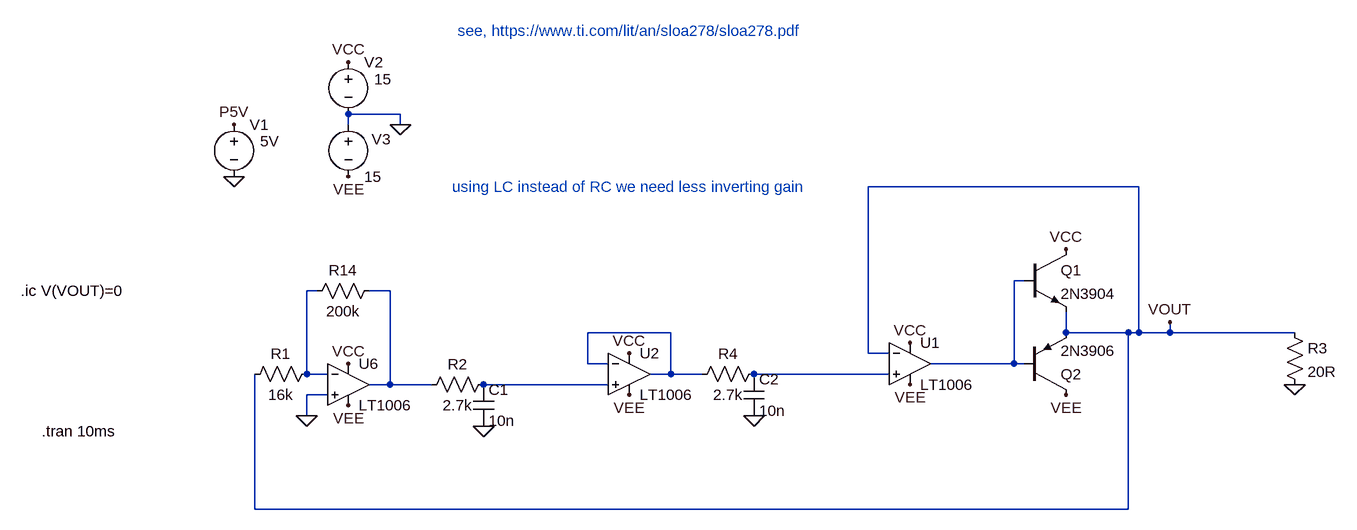
[diagram p0: schematic Draft02.asc]
Draft02.asc, the LTspice schematic file:
Version 4
SHEET 1 2720 868
WIRE -496 -112 -576 -112
WIRE -576 -96 -576 -112
WIRE -496 -96 -496 -112
WIRE 640 0 224 0
WIRE 464 144 448 144
WIRE -624 160 -640 160
WIRE -512 160 -544 160
WIRE -80 224 -208 224
WIRE 528 224 528 192
WIRE 624 224 528 224
WIRE 640 224 640 0
WIRE 640 224 624 224
WIRE 688 224 688 208
WIRE 688 224 640 224
WIRE 880 224 688 224
WIRE 224 256 224 0
WIRE 256 256 224 256
WIRE -208 272 -208 224
WIRE -176 272 -208 272
WIRE 448 272 448 144
WIRE 448 272 320 272
WIRE 464 272 448 272
WIRE -640 288 -640 160
WIRE -608 288 -640 288
WIRE -80 288 -80 224
WIRE -80 288 -112 288
WIRE -32 288 -80 288
WIRE 256 288 48 288
WIRE -512 304 -512 160
WIRE -512 304 -544 304
WIRE -448 304 -512 304
WIRE -176 304 -368 304
WIRE -608 320 -640 320
WIRE -640 352 -640 320
WIRE -720 496 -720 288
WIRE 624 496 624 224
WIRE 624 496 -720 496
FLAG -496 -96 0
FLAG -576 -192 VCC
FLAG -576 -16 VEE
FLAG -752 -96 P5V
FLAG -752 -16 0
FLAG -640 352 0
FLAG -576 272 VCC
FLAG -576 336 VEE
FLAG -368 368 0
FLAG 288 240 VCC
FLAG 288 304 VEE
FLAG 688 208 VOUT
FLAG -144 256 VCC
FLAG -144 320 VEE
FLAG 48 352 0
FLAG 528 96 VCC
FLAG 528 320 VEE
FLAG 880 304 0
SYMBOL voltage -576 -208 R0
WINDOW 123 0 0 Left 0
WINDOW 39 0 0 Left 0
WINDOW 3 40 42 Left 2
SYMATTR Value 15
SYMATTR InstName V2
SYMBOL voltage -576 -112 R0
WINDOW 123 0 0 Left 0
WINDOW 39 0 0 Left 0
WINDOW 0 36 39 Left 2
SYMATTR InstName V3
SYMATTR Value 15
SYMBOL voltage -752 -112 R0
WINDOW 123 0 0 Left 0
WINDOW 39 0 0 Left 0
WINDOW 3 40 42 Left 2
SYMATTR Value 5V
SYMATTR InstName V1
SYMBOL OpAmps\\LT1006 -576 240 R0
SYMATTR InstName U6
SYMBOL res -624 272 R90
WINDOW 0 0 56 VBottom 2
WINDOW 3 32 56 VTop 2
SYMATTR InstName R1
SYMATTR Value 16k
SYMBOL res -528 144 R90
WINDOW 0 0 56 VBottom 2
WINDOW 3 32 56 VTop 2
SYMATTR InstName R14
SYMATTR Value 200k
SYMBOL cap -384 304 R0
SYMATTR InstName C1
SYMATTR Value 10n
SYMBOL OpAmps\\LT1006 288 208 R0
SYMATTR InstName U1
SYMBOL OpAmps\\LT1006 -144 224 R0
SYMATTR InstName U2
SYMBOL cap 32 288 R0
SYMATTR InstName C2
SYMATTR Value 10n
SYMBOL npn 464 96 R0
SYMATTR InstName Q1
SYMATTR Value 2N3904
SYMBOL pnp 464 320 M180
SYMATTR InstName Q2
SYMATTR Value 2N3906
SYMBOL res 864 208 R0
SYMATTR InstName R3
SYMATTR Value 20R
SYMBOL res -352 288 R90
WINDOW 0 0 56 VBottom 2
WINDOW 3 32 56 VTop 2
SYMATTR InstName R2
SYMATTR Value 2.7k
SYMBOL res 64 272 R90
WINDOW 0 0 56 VBottom 2
WINDOW 3 32 56 VTop 2
SYMATTR InstName R4
SYMATTR Value 2.7k
TEXT -1048 376 Left 2 !.tran 10ms
TEXT -1080 160 Left 2 !.ic V(VOUT)=0
TEXT -408 -240 Left 2 ;see, https://www.ti.com/lit/an/sloa278/sloa278.pdf
TEXT -416 0 Left 2 ;using LC instead of RC we need less inverting gain

The netlist it stands for:
* Draft02.asc
V2 VCC 0 15
V3 0 VEE 15
V1 P5V 0 5V
XU6 0 N002 VCC VEE N003 LT1006  ; pins In+ In- V+ V- OUT
R1 N002 VOUT 16k
R14 N003 N002 200k
C1 N006 0 10n
XU1 N005 VOUT VCC VEE N001 LT1006  ; pins In+ In- V+ V- OUT
XU2 N006 N004 VCC VEE N004 LT1006  ; pins In+ In- V+ V- OUT
C2 N005 0 10n
Q1 VCC N001 VOUT 0 2N3904
Q2 VEE N001 VOUT 0 2N3906
R3 VOUT 0 20R
R2 N006 N003 2.7k
R4 N005 N004 2.7k
.model NPN NPN
.model PNP PNP
.lib standard.bjt
.tran 10ms
.ic V(VOUT)=0
* see, https://www.ti.com/lit/an/sloa278/sloa278.pdf
* using LC instead of RC we need less inverting gain
.lib LTC.lib
.backanno
.end